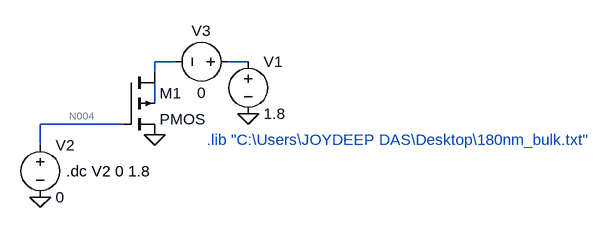
[diagram p0: schematic tut2 Q10 PMOS Vgs vdd.asc]
tut2 Q10 PMOS Vgs vdd.asc, the LTspice schematic file:
Version 4
SHEET 1 896 680
WIRE 144 64 112 64
WIRE 256 64 224 64
WIRE 112 80 112 64
WIRE 112 128 112 96
WIRE 64 160 -64 160
WIRE -64 192 -64 160
FLAG 256 144 0
FLAG -64 272 0
FLAG 112 176 0
SYMBOL voltage 256 48 R0
WINDOW 123 0 0 Left 2
WINDOW 39 0 0 Left 2
SYMATTR InstName V1
SYMATTR Value 1.8
SYMBOL voltage -64 176 R0
WINDOW 123 0 0 Left 2
WINDOW 39 0 0 Left 2
SYMATTR InstName V2
SYMATTR Value 0
SYMBOL voltage 240 64 R90
WINDOW 0 -32 56 VBottom 2
WINDOW 3 32 56 VTop 2
WINDOW 123 0 0 Left 2
WINDOW 39 0 0 Left 2
SYMATTR InstName V3
SYMATTR Value 0
SYMBOL pmos4 64 80 R0
SYMATTR InstName M1
TEXT -24 232 Left 2 !.dc V2 0 1.8
TEXT 192 184 Left 2 ;.lib "C:\\Users\\JOYDEEP DAS\\Desktop\\180nm_bulk.txt"

The netlist it stands for:
* tut2 Q10 PMOS Vgs vdd.asc
V1 N002 0 1.8
V2 N004 0 0
V3 N002 N001 0
M1 N001 N004 0 N003 PMOS
.model NMOS NMOS
.model PMOS PMOS
.lib standard.mos
.dc V2 0 1.8
* .lib "C:\Users\JOYDEEP DAS\Desktop\180nm_bulk.txt"
.backanno
.end

* Results of the author's LTspice run, read from the files saved beside the schematic
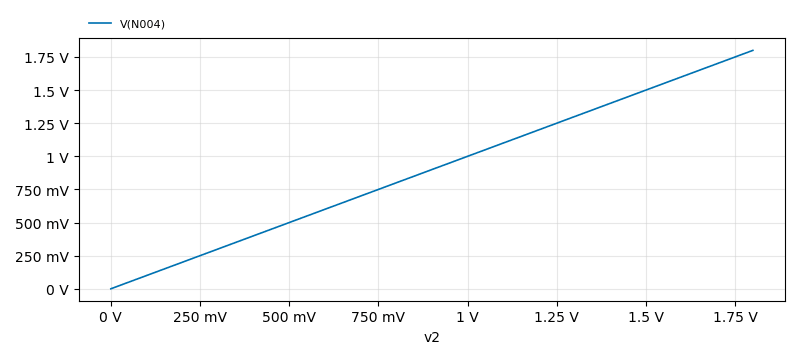
[diagram p1: DC transfer characteristic of tut2 Q10 PMOS Vgs vdd.asc, plotted from the saved traces]
* DC transfer characteristic, 1 run:
*   V(N004): 0 V at v2=0 V, 1.8 V at v2=1.8 V, min 0 V, max 1.8 V